# Altium schematic sheet i2c.SchDoc
size A
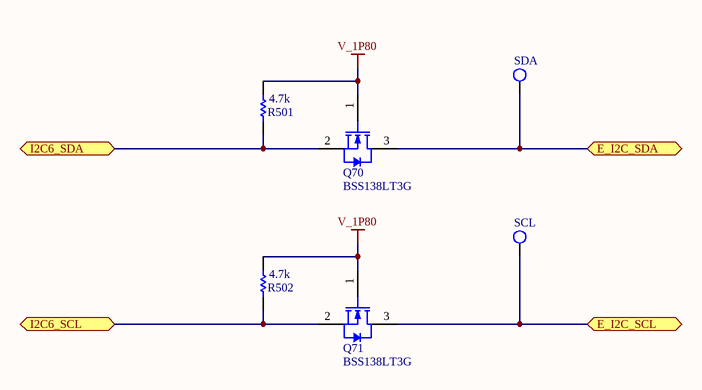
[diagram p0: i2c.SchDoc]

## Parts
Q70  BSS138LT3G  [ONSC-SOT-23-3-318-08_V]
Q71  BSS138LT3G  [ONSC-SOT-23-3-318-08_V]
R501  value 4.7k  [RESC0603(1608)_N]  (hidden comment: 4K7 5% 0603(1608))
R502  value 4.7k  [RESC0603(1608)_N]  (hidden comment: 4K7 5% 0603(1608))
SCL  Testpoint  [Tespoint_Keystone]  (value not drawn)
SDA  Testpoint  [Tespoint_Keystone]  (value not drawn)

## Ports
E_I2C_SCL (bidir), E_I2C_SDA (bidir), I2C6_SCL (bidir), I2C6_SDA (bidir)

## Nets
V_1P80: Q70.1(G) Q71.1(G) R501.2 R502.2
E_I2C_SCL: Q71.3(D) SCL.1(TP) ; port E_I2C_SCL
E_I2C_SDA: Q70.3(D) SDA.1(TP) ; port E_I2C_SDA
I2C6_SCL: Q71.2(S) R502.1 ; port I2C6_SCL
I2C6_SDA: Q70.2(S) R501.1 ; port I2C6_SDA

## Library data of the parts
Q70 Q71 = CMP-1058-00765-1: Power MOSFET, 200 mA, 50 V, N-Channel, 3-Pin SOT-23, Pb-Free, Tape and Reel; Manufacturer: On Semiconductor; PD Max (W): 0.225; Channel Polarity: N Channel; Crss Typ (pF): 3.5; Configuration: Single; ID Max (A): 0.2; Ciss Typ (pF): 40; V(BR)DSS Min (V): 50; VGS(th) Max (V): 1.5; Coss Typ (pF): 12; VGS Max (V): 20; ComponentLink2URL: http://www.onsemi.com/pub_link/Collateral/BSS138LT1-D.PDF; PackageDescription: 3-Pin Small Outline Transistor, Body 2.92 x 1.3 mm, Pitch 0.95 mm; Package Type: SOT-23-3; Mounting Technology: Surface Mount; ComponentLink1Description: Manufacturer URL; PackageVersion: Rev. AP, 11/2009; ComponentLink3Description: Package Specification; DatasheetVersion: Rev. 8; RoHS: Pb-Free; Packing: Tape and Reel; PackageReference: SOT-23-3-318-08; PartNumber: BSS138LT3G; ComponentLink3URL: http://www.onsemi.cn/pub_link/Collateral/318-08.PDF; ComponentLink1URL: http://www.onsemi.com/; ComponentLink2Description: Datasheet; Supplier 1: Digi-Key; Supplier Part Number 1: BSS138LT1GOSCT-ND
R501 R502 = CMP-1012-00090-1: 4K7 0.1W 5% 0603 (1608 Metric)  SMD; Case-Metric: 1608; Case-EIA: 0603; Tolerance: 5 %; Technology: SMT; Power: 0.1 W; Supplier 1: Digi-Key; Supplier Part Number 1: P4.7KGCT-ND
SCL SDA = TestPoint: Supplier 1: Digi-Key; Supplier Part Number 1: 5000K-ND